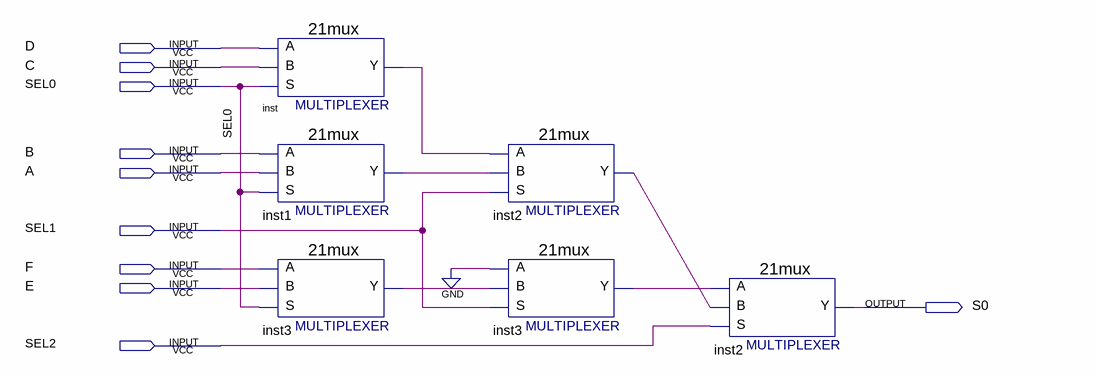
[diagram p0: schematic sheet]
// Quartus schematic tarea03_mux_2_a_1.bdf as structural Verilog: 6 symbols, 10 pins
module tarea03_mux_2_a_1 (
  input  D,
  input  C,
  input  SEL0,
  input  B,
  input  A,
  input  SEL1,
  input  F,
  input  E,
  input  SEL2,
  output S0
);

  wire inst1_y, inst2_y, inst3_y, inst3_y_2, inst_y;

  \21mux  inst (.S(SEL0), .B(C), .A(D), .Y(inst_y));
  \21mux  inst1 (.S(SEL0), .B(A), .A(B), .Y(inst1_y));
  \21mux  inst3 (.S(SEL0), .B(E), .A(F), .Y(inst3_y));
  \21mux  inst2 (.S(SEL1), .B(inst1_y), .A(inst_y), .Y(inst2_y));
  \21mux  inst3_dup2 (.S(SEL1), .B(inst3_y), .A(1'b0), .Y(inst3_y_2));
  \21mux  inst2_dup2 (.S(SEL2), .B(inst2_y), .A(inst3_y_2), .Y(S0));
endmodule
